# Altium schematic sheet RJ45_Analog_Output.SchDoc
size A4; CompanyName: Technische Hochschule Nürnberg Georg Simon Ohm; Organization: UltraZohm; Address1: Kesslerplatz 12; Address2: 90489 Nürnberg; Address3: GERMANY; SheetNumber: 4; SheetTotal: 6; Website: www.ultrazohm.com
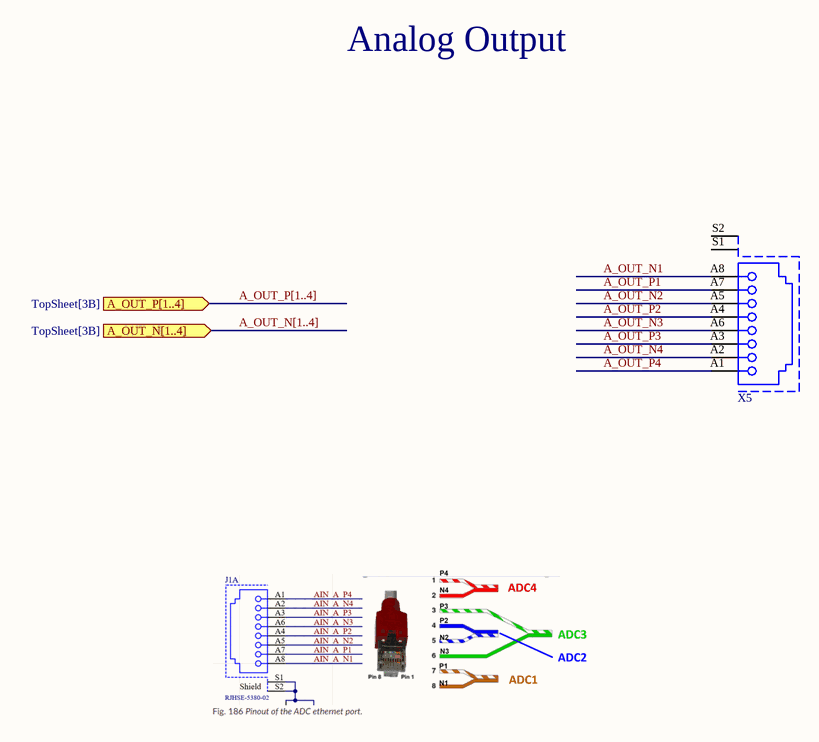
[diagram p0: RJ45_Analog_Output.SchDoc]

## Parts
X5  (no value)  [R-RJ45R10P-B000]

## Ports
A_OUT_N[1..4] (in, see TopSheet[3B]), A_OUT_P[1..4] (in, see TopSheet[3B])

## Nets
A_OUT_N1: X5.A8
A_OUT_N2: X5.A5
A_OUT_N3: X5.A6
A_OUT_N4: X5.A2
A_OUT_P1: X5.A7
A_OUT_P2: X5.A4
A_OUT_P3: X5.A3
A_OUT_P4: X5.A1

Not connected (* = marked no-connect by the designer): X5 S1 S2

## Buses and harness runs
bus A_OUT_N[1..4] = port A_OUT_N[1..4]
bus A_OUT_P[1..4] = port A_OUT_P[1..4]

## Notes on the sheet
- Analog Output
- Title
- Revision:
- Design Engineer:
- Date:
- Project:
- Sheet
- of

## Library data of the parts
X5 = R-RJ45R10P-B000: RJ45Receptacle 1 Shielded Bend insert Without LED 0℃~+70℃ Plugin Ethernet Connectors / Modular Connectors (RJ45 RJ11) ROHS; Manufacturer: Ckmtw(Shenzhen Cankemeng); Created from: KIlhan; Manufacturer Part Number: R-RJ45R10P-B000; PartID: 57; Created On: 20/03/2025 09:19:07; ComponentLink1Description: Datasheet; ComponentLink1URL: https://jlcpcb.com/api/file/downloadByFileSystemAccessId/8588892085580021760; Last Updated: 18/05/2025 18:44:47; Mounting Type: THT; Operating Temperature: 0 °C to +70 °C; Series: RJ45; Supplier 1: LCSC; Supplier Part Number 1: C386758; Value: R-RJ45R10P-B000; LCSC Part Number: C386758